# Altium schematic sheet stock_ticker.SchDoc
size A; SheetNumber: 1; SheetTotal: 1
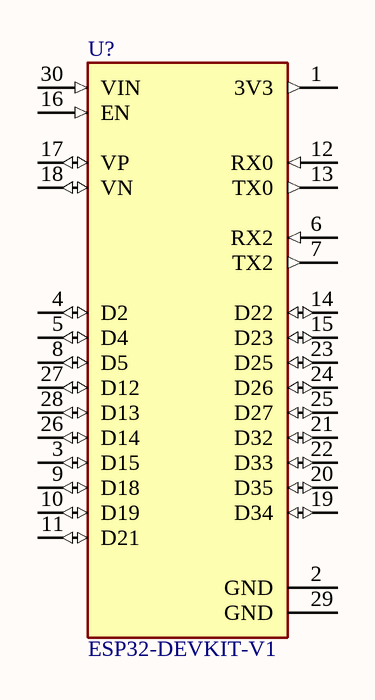
[diagram p0: stock_ticker.SchDoc]

## Parts
U?  ESP32-DEVKIT-V1  [MODULE_ESP32_DEVKIT_V1]

## Nets

Not connected (* = marked no-connect by the designer): U? 1(3V3) 2(GND) 3(D15) 4(D2) 5(D4) 6(RX2) 7(TX2) 8(D5) 9(D18) 10(D19) 11(D21) 12(RX0) 13(TX0) 14(D22) 15(D23) 16(EN) 17(VP) 18(VN) 19(D34) 20(D35) 21(D32) 22(D33) 23(D25) 24(D26) 25(D27) 26(D14) 27(D12) 28(D13) 29(GND) 30(VIN)

## Library data of the parts
U? = CMP-003-000000-1: Dual core, Wi-Fi: 2.4 GHz up to 150 Mbits/s,BLE (Bluetooth Low Energy) and legacy Bluetooth, 32 bits, Up to 240 MHz; MF: Do it; Pin Count: 30; Value: *; SnapEDA_Link: https://www.snapeda.com/parts/ESP32-DEVKIT-V1/Do+it/view-part/?ref=snap; Source: ESP32-DEVKIT-V1.SchLib; Check_prices: https://www.snapeda.com/parts/ESP32-DEVKIT-V1/Do+it/view-part/?ref=eda; Package: None; MP: ESP32-DEVKIT-V1; Design Item ID: ESP32-DEVKIT-V1; Component Type: Standard